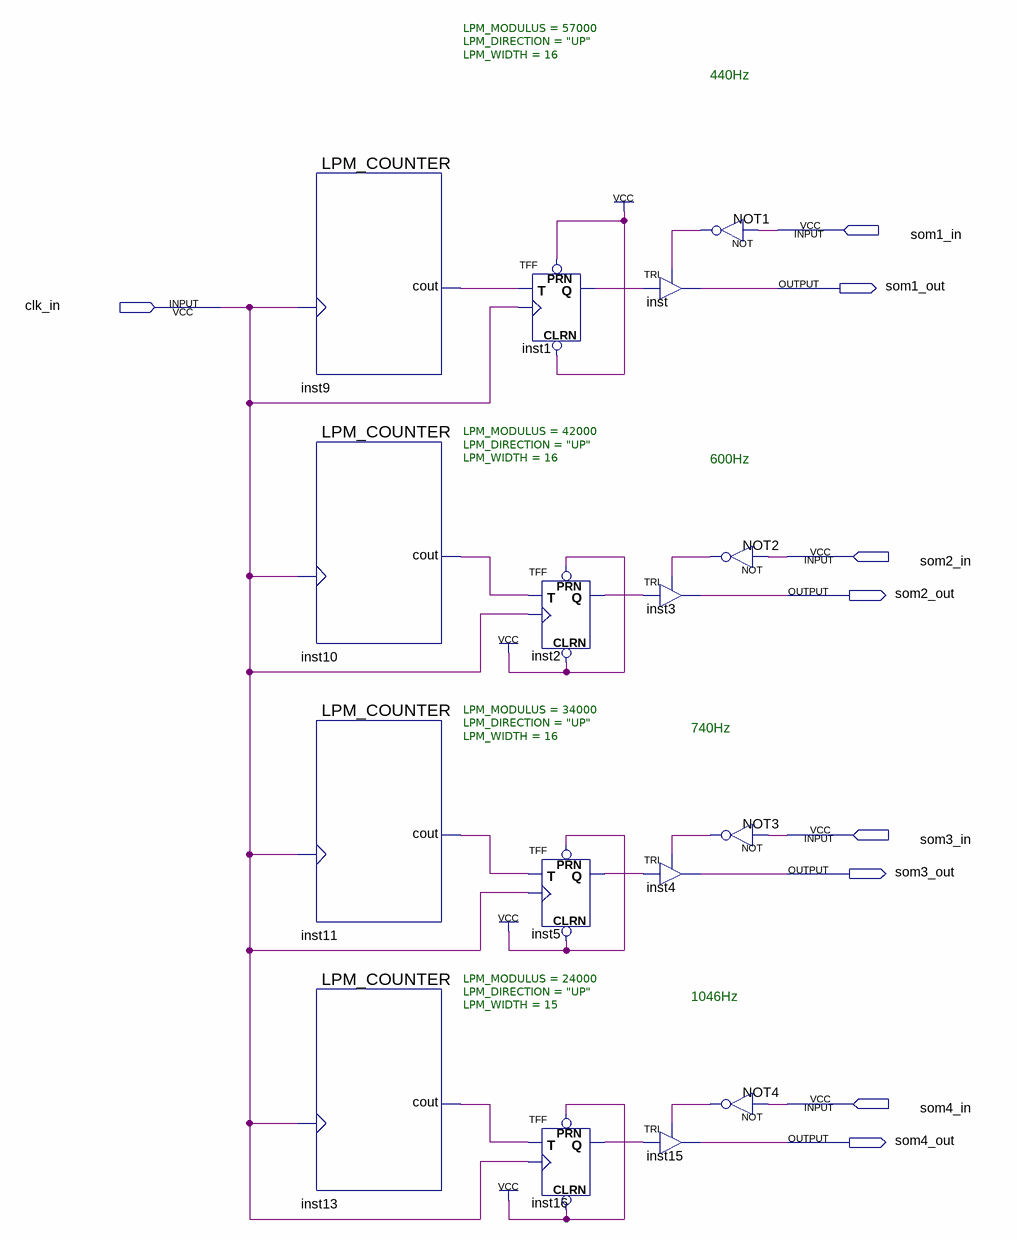
[diagram p0: schematic sheet]
// Quartus schematic buzzer.bdf as structural Verilog: 16 symbols, 9 pins
module buzzer (
  input  som1_in,
  input  clk_in,
  input  som2_in,
  input  som3_in,
  input  som4_in,
  output som1_out,
  output som2_out,
  output som3_out,
  output som4_out
);

  wire inst1_q, inst2_q, inst5_q, inst9_cout, inst10_cout, inst11_cout, inst13_cout, inst16_q, NOT1_out,
       NOT2_out, NOT3_out, NOT4_out;

  LPM_COUNTER #(.LPM_MODULUS(57000), .LPM_DIRECTION("UP"), .LPM_WIDTH(16)) inst9 (.clock(clk_in), .cout(inst9_cout));
  LPM_COUNTER #(.LPM_MODULUS(42000), .LPM_DIRECTION("UP"), .LPM_WIDTH(16)) inst10 (.clock(clk_in), .cout(inst10_cout));
  LPM_COUNTER #(.LPM_MODULUS(34000), .LPM_DIRECTION("UP"), .LPM_WIDTH(16)) inst11 (.clock(clk_in), .cout(inst11_cout));
  LPM_COUNTER #(.LPM_MODULUS(24000), .LPM_DIRECTION("UP"), .LPM_WIDTH(15)) inst13 (.clock(clk_in), .cout(inst13_cout));
  TFF inst1 (.PRN(1'b1), .CLRN(1'b1), .T(inst9_cout), .CLK(clk_in), .Q(inst1_q));
  TFF inst2 (.PRN(1'b1), .CLRN(1'b1), .T(inst10_cout), .CLK(clk_in), .Q(inst2_q));
  TFF inst5 (.PRN(1'b1), .CLRN(1'b1), .T(inst11_cout), .CLK(clk_in), .Q(inst5_q));
  TFF inst16 (.PRN(1'b1), .CLRN(1'b1), .T(inst13_cout), .CLK(clk_in), .Q(inst16_q));
  not NOT1 (NOT1_out, som1_in);
  TRI inst (.IN(inst1_q), .OE(NOT1_out), .OUT(som1_out));
  TRI inst3 (.IN(inst2_q), .OE(NOT2_out), .OUT(som2_out));
  TRI inst4 (.IN(inst5_q), .OE(NOT3_out), .OUT(som3_out));
  TRI inst15 (.IN(inst16_q), .OE(NOT4_out), .OUT(som4_out));
  not NOT2 (NOT2_out, som2_in);
  not NOT3 (NOT3_out, som3_in);
  not NOT4 (NOT4_out, som4_in);

  // Notes on the sheet:
  //   440Hz
  //   600Hz
  //   740Hz
  //   1046Hz
endmodule
